# Altium schematic sheet Analog_Sensors_Sheet.SchDoc
size A2; SheetNumber: 3; SheetTotal: 4
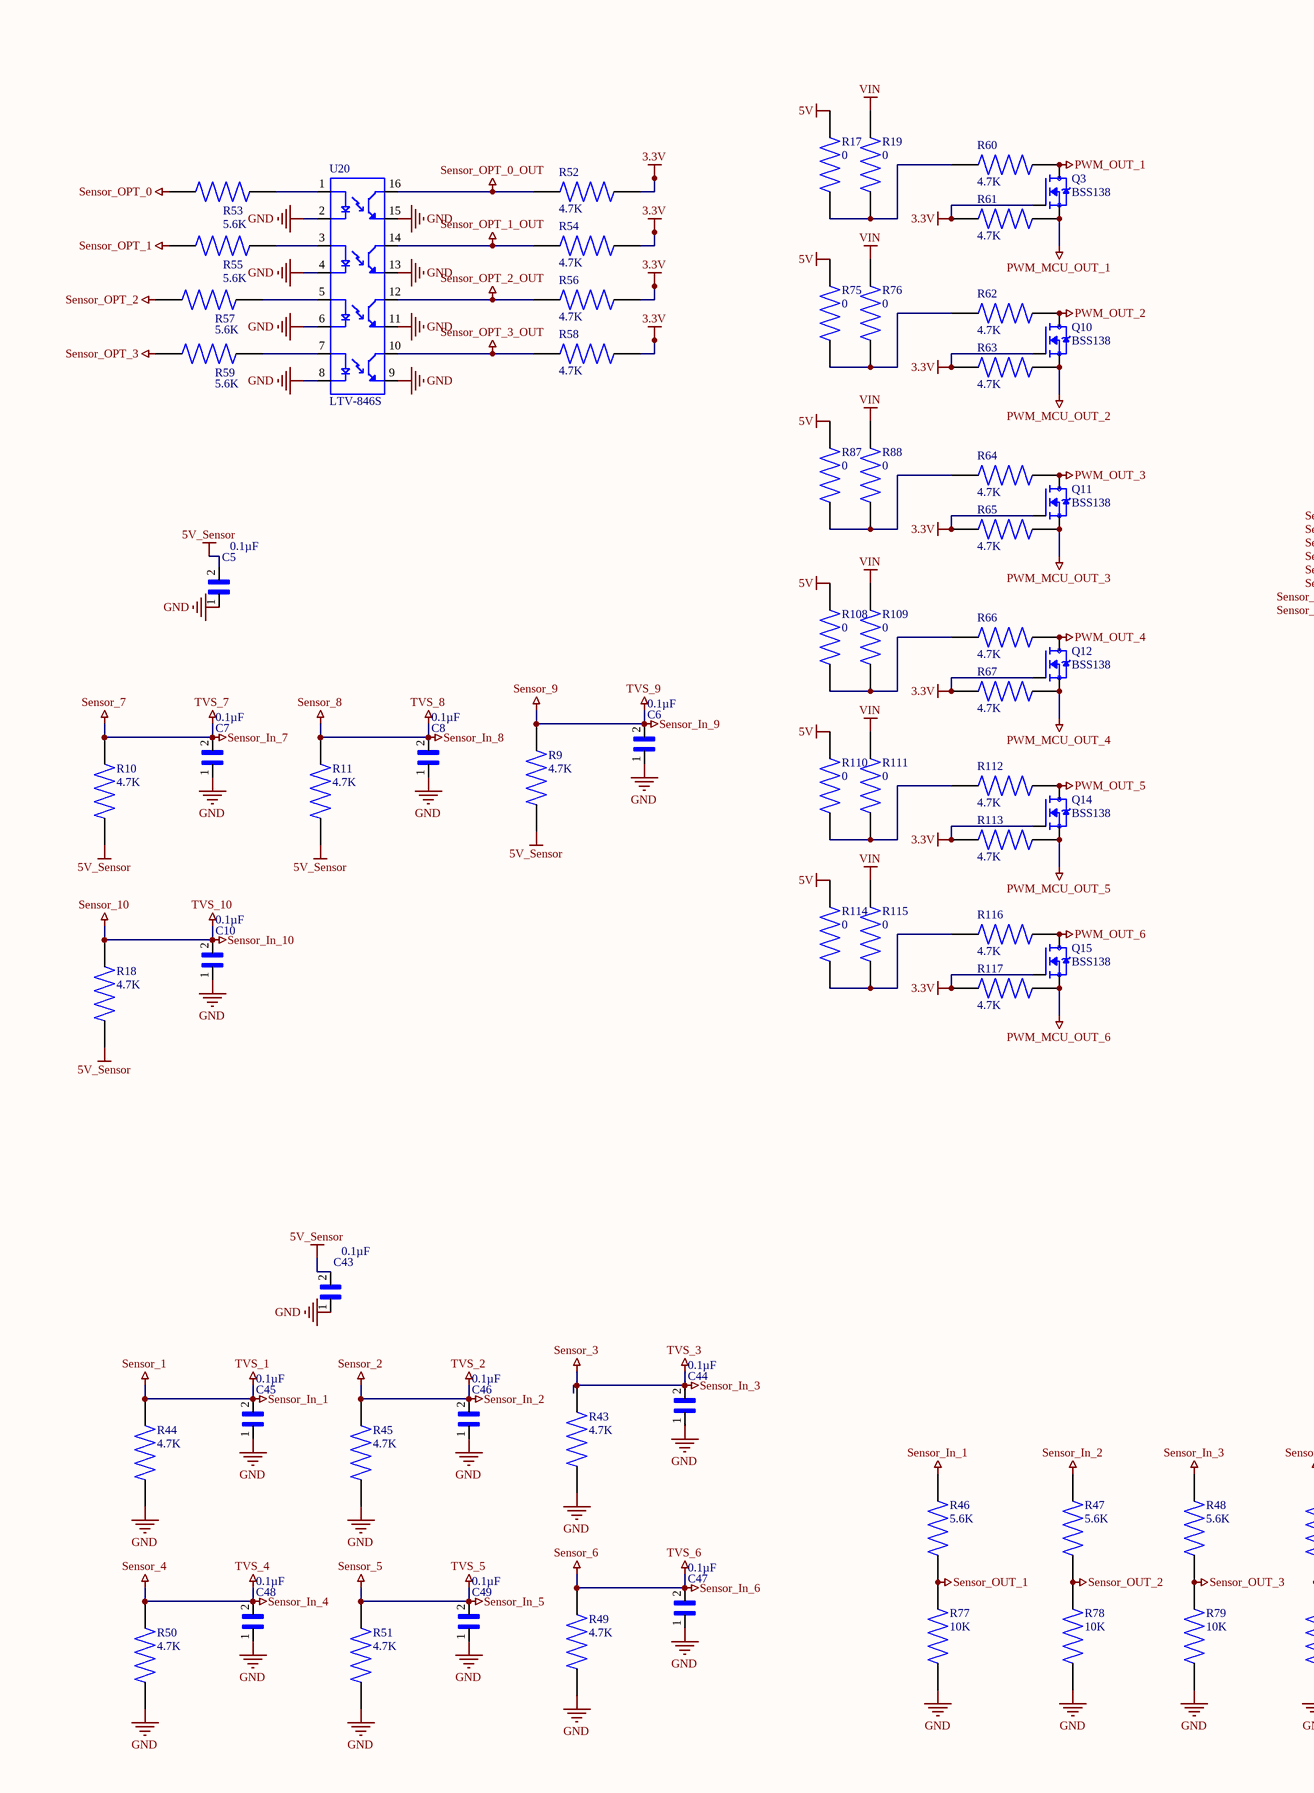
[diagram p0: Analog_Sensors_Sheet.SchDoc, left]
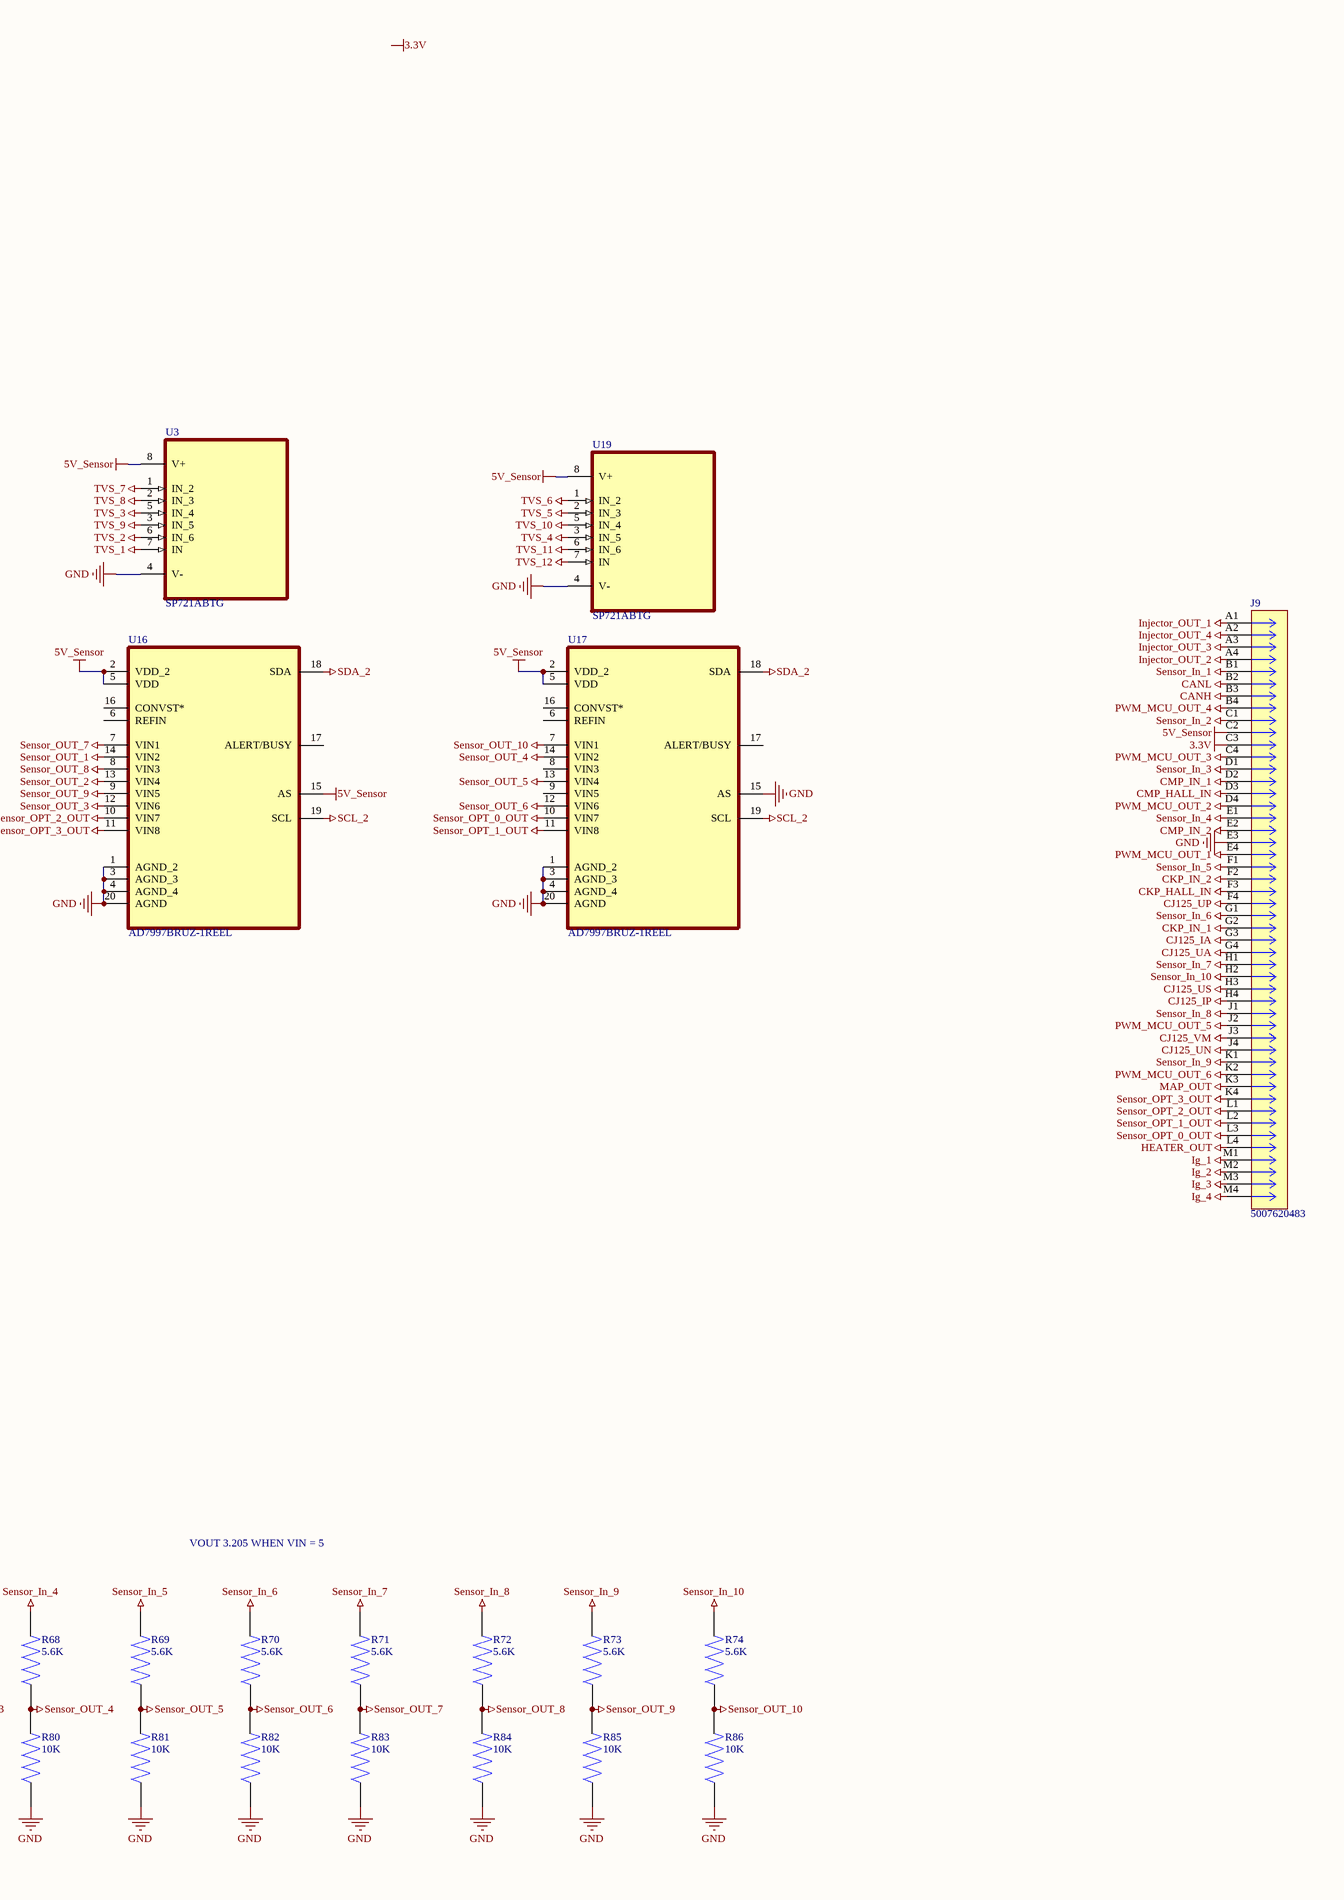
[diagram p1: Analog_Sensors_Sheet.SchDoc, right]

## Parts
C5  0.1µF  [CAPC1608X90N]
C6  0.1µF  [CAPC1608X90N]
C7  0.1µF  [CAPC1608X90N]
C8  0.1µF  [CAPC1608X90N]
C10  0.1µF  [CAPC1608X90N]
C43  0.1µF  [CAPC1608X90N]
C44  0.1µF  [CAPC1608X90N]
C45  0.1µF  [CAPC1608X90N]
C46  0.1µF  [CAPC1608X90N]
C47  0.1µF  [CAPC1608X90N]
C48  0.1µF  [CAPC1608X90N]
C49  0.1µF  [CAPC1608X90N]
J9  5007620483  [CONN_SD-500762-001_MOL]
Q3  BSS138  [SOT95P240X111-3N]
Q10  BSS138  [SOT95P240X111-3N]
Q11  BSS138  [SOT95P240X111-3N]
Q12  BSS138  [SOT95P240X111-3N]
Q14  BSS138  [SOT95P240X111-3N]
Q15  BSS138  [SOT95P240X111-3N]
R9  4.7K  [RESC3116X65N]
R10  4.7K  [RESC3116X65N]
R11  4.7K  [RESC3116X65N]
R17  0  [RESC3116X65N]
R18  4.7K  [RESC3116X65N]
R19  0  [RESC3116X65N]
R43  4.7K  [RESC3116X65N]
R44  4.7K  [RESC3116X65N]
R45  4.7K  [RESC3116X65N]
R46  5.6K  [RESC3116X65N]
R47  5.6K  [RESC3116X65N]
R48  5.6K  [RESC3116X65N]
R49  4.7K  [RESC3116X65N]
R50  4.7K  [RESC3116X65N]
R51  4.7K  [RESC3116X65N]
R52  4.7K  [RES_ERJS06J472V]
R53  5.6K  [RESC3216X70N]
R54  4.7K  [RES_ERJS06J472V]
R55  5.6K  [RESC3216X70N]
R56  4.7K  [RES_ERJS06J472V]
R57  5.6K  [RESC3216X70N]
R58  4.7K  [RES_ERJS06J472V]
R59  5.6K  [RESC3216X70N]
R60  4.7K  [RESC3116X65N]
R61  4.7K  [RESC3116X65N]
R62  4.7K  [RESC3116X65N]
R63  4.7K  [RESC3116X65N]
R64  4.7K  [RESC3116X65N]
R65  4.7K  [RESC3116X65N]
R66  4.7K  [RESC3116X65N]
R67  4.7K  [RESC3116X65N]
R68  5.6K  [RESC3116X65N]
R69  5.6K  [RESC3116X65N]
R70  5.6K  [RESC3116X65N]
R71  5.6K  [RESC3116X65N]
R72  5.6K  [RESC3116X65N]
R73  5.6K  [RESC3116X65N]
R74  5.6K  [RESC3116X65N]
R75  0  [RESC3116X65N]
R76  0  [RESC3116X65N]
R77  10K  [RESC3116X65N]
R78  10K  [RESC3116X65N]
R79  10K  [RESC3116X65N]
R80  10K  [RESC3116X65N]
R81  10K  [RESC3116X65N]
R82  10K  [RESC3116X65N]
R83  10K  [RESC3116X65N]
R84  10K  [RESC3116X65N]
R85  10K  [RESC3116X65N]
R86  10K  [RESC3116X65N]
R87  0  [RESC3116X65N]
R88  0  [RESC3116X65N]
R108  0  [RESC3116X65N]
R109  0  [RESC3116X65N]
R110  0  [RESC3116X65N]
R111  0  [RESC3116X65N]
R112  4.7K  [RESC3116X65N]
R113  4.7K  [RESC3116X65N]
R114  0  [RESC3116X65N]
R115  0  [RESC3116X65N]
R116  4.7K  [RESC3116X65N]
R117  4.7K  [RESC3116X65N]
U3  SP721ABTG  [SOIC127P600X175-8N]
U16  AD7997BRUZ-1REEL  [SOP65P640X120-20N]
U17  AD7997BRUZ-1REEL  [SOP65P640X120-20N]
U19  SP721ABTG  [SOIC127P600X175-8N]
U20  LTV-846S  [SOIC254P1016X460-16N]

## Nets
3.3V: J9.C3 Q3.1(G) Q10.1(G) Q11.1(G) Q12.1(G) Q14.1(G) Q15.1(G) R52.2 R54.2 R56.2 R58.2 R61.2 R63.2 R65.2 R67.2 R113.2 R117.2
5V: R17.2 R75.2 R87.2 R108.2 R110.2 R114.2
5V_Sensor: C5.2 C43.2 J9.C2 R9.1 R10.1 R11.1 R18.1 U3.8(V+) U16.2(VDD_2) U16.5(VDD) U16.15(AS) U17.2(VDD_2) U17.5(VDD) U19.8(V+)
CANH: J9.B3
CANL: J9.B2
CJ125_IA: J9.G3
CJ125_IP: J9.H4
CJ125_UA: J9.G4
CJ125_UN: J9.J4
CJ125_UP: J9.F4
CJ125_US: J9.H3
CJ125_VM: J9.J3
CKP_HALL_IN: J9.F3
CKP_IN_1: J9.G2
CKP_IN_2: J9.F2
CMP_HALL_IN: J9.D3
CMP_IN_1: J9.D2
CMP_IN_2: J9.E2
GND: C5.1 C6.1 C7.1 C8.1 C10.1 C43.1 C44.1 C45.1 C46.1 C47.1 C48.1 C49.1 J9.E3 R43.1 R44.1 R45.1 R49.1 R50.1 R51.1 R77.1 R78.1 R79.1 R80.1 R81.1 R82.1 R83.1 R84.1 R85.1 R86.1 U3.4(V-) U16.1(AGND_2) U16.3(AGND_3) U16.4(AGND_4) U16.20(AGND) U17.1(AGND_2) U17.3(AGND_3) U17.4(AGND_4) U17.15(AS) U17.20(AGND) U19.4(V-) U20.2(C1) U20.4(C2) U20.6(C3) U20.8(C4) U20.9(ET4) U20.11(ET3) U20.13(ET2) U20.15(ET1)
HEATER_OUT: J9.L4
Ig_1: J9.M1
Ig_2: J9.M2
Ig_3: J9.M3
Ig_4: J9.M4
Injector_OUT_1: J9.A1
Injector_OUT_2: J9.A4
Injector_OUT_3: J9.A3
Injector_OUT_4: J9.A2
MAP_OUT: J9.K3
PWM_MCU_OUT_1: J9.E4 Q3.2(S) R61.1
PWM_MCU_OUT_2: J9.D4 Q10.2(S) R63.1
PWM_MCU_OUT_3: J9.C4 Q11.2(S) R65.1
PWM_MCU_OUT_4: J9.B4 Q12.2(S) R67.1
PWM_MCU_OUT_5: J9.J2 Q14.2(S) R113.1
PWM_MCU_OUT_6: J9.K2 Q15.2(S) R117.1
PWM_OUT_1: Q3.3(D) R60.1
PWM_OUT_2: Q10.3(D) R62.1
PWM_OUT_3: Q11.3(D) R64.1
PWM_OUT_4: Q12.3(D) R66.1
PWM_OUT_5: Q14.3(D) R112.1
PWM_OUT_6: Q15.3(D) R116.1
SCL_2: U16.19(SCL) U17.19(SCL)
SDA_2: U16.18(SDA) U17.18(SDA)
Sensor_1: C45.2 J9.B1 R44.2 R46.2 U3.7(IN)  [also labelled Sensor_In_1, TVS_1]
Sensor_2: C46.2 J9.C1 R45.2 R47.2 U3.6(IN_6)  [also labelled Sensor_In_2, TVS_2]
Sensor_3: C44.2 J9.D1 R43.2 R48.2 U3.5(IN_4)  [also labelled Sensor_In_3, TVS_3]
Sensor_4: C48.2 J9.E1 R50.2 R68.2 U19.3(IN_5)  [also labelled Sensor_In_4, TVS_4]
Sensor_5: C49.2 J9.F1 R51.2 R69.2 U19.2(IN_3)  [also labelled Sensor_In_5, TVS_5]
Sensor_6: C47.2 J9.G1 R49.2 R70.2 U19.1(IN_2)  [also labelled Sensor_In_6, TVS_6]
Sensor_7: C7.2 J9.H1 R10.2 R71.2 U3.1(IN_2)  [also labelled Sensor_In_7, TVS_7]
Sensor_8: C8.2 J9.J1 R11.2 R72.2 U3.2(IN_3)  [also labelled Sensor_In_8, TVS_8]
Sensor_9: C6.2 J9.K1 R9.2 R73.2 U3.3(IN_5)  [also labelled Sensor_In_9, TVS_9]
Sensor_10: C10.2 J9.H2 R18.2 R74.2 U19.5(IN_4)  [also labelled Sensor_In_10, TVS_10]
Sensor_OPT_0: R53.1
Sensor_OPT_0_OUT: J9.L3 R52.1 U17.10(VIN7) U20.16(CT1)
Sensor_OPT_1: R55.1
Sensor_OPT_1_OUT: J9.L2 R54.1 U17.11(VIN8) U20.14(CT2)
Sensor_OPT_2: R57.1
Sensor_OPT_2_OUT: J9.L1 R56.1 U16.10(VIN7) U20.12(CT3)
Sensor_OPT_3: R59.1
Sensor_OPT_3_OUT: J9.K4 R58.1 U16.11(VIN8) U20.10(CT4)
Sensor_OUT_1: R46.1 R77.2 U16.14(VIN2)
Sensor_OUT_2: R47.1 R78.2 U16.13(VIN4)
Sensor_OUT_3: R48.1 R79.2 U16.12(VIN6)
Sensor_OUT_4: R68.1 R80.2 U17.14(VIN2)
Sensor_OUT_5: R69.1 R81.2 U17.13(VIN4)
Sensor_OUT_6: R70.1 R82.2 U17.12(VIN6)
Sensor_OUT_7: R71.1 R83.2 U16.7(VIN1)
Sensor_OUT_8: R72.1 R84.2 U16.8(VIN3)
Sensor_OUT_9: R73.1 R85.2 U16.9(VIN5)
Sensor_OUT_10: R74.1 R86.2 U17.7(VIN1)
TVS_11: U19.6(IN_6)
TVS_12: U19.7(IN)
VIN: R19.2 R76.2 R88.2 R109.2 R111.2 R115.2
NetR17_1: R17.1 R19.1 R60.2
NetR53_2: R53.2 U20.1(A1)
NetR55_2: R55.2 U20.3(A2)
NetR57_2: R57.2 U20.5(A3)
NetR59_2: R59.2 U20.7(A4)
NetR62_2: R62.2 R75.1 R76.1
NetR64_2: R64.2 R87.1 R88.1
NetR66_2: R66.2 R108.1 R109.1
NetR110_1: R110.1 R111.1 R112.2
NetR114_1: R114.1 R115.1 R116.2

Not connected (* = marked no-connect by the designer): U16 6(REFIN) 16(CONVST*) 17(ALERT/BUSY); U17 6(REFIN) 8(VIN3) 9(VIN5) 16(CONVST*) 17(ALERT/BUSY)

## Notes on the sheet
- VOUT 3.205 WHEN VIN = 5
- Labels drawn without touching a wire or pin: 3.3V

## Library data of the parts
C5-C8 C10 C43-C49 = 06035C104MAZ2A: Multilayer Ceramic Capacitors MLCC - SMD/SMT; Package: None; Price: None; Value: *; MP: 06035C104MAZ2A; Availability: Unavailable
Q3 Q10-Q12 Q14 Q15 = BSS138: N-Channel 50 V 220mA (Ta) 350mW (Ta) Surface Mount SOT-23-3; MF: onsemi; SnapEDA_Link: https://www.snapeda.com/parts/BSS138/Onsemi/view-part/?ref=snap; Package: SOT-23-3 ON Semiconductor; Value: *; MP: BSS138; Check_prices: https://www.snapeda.com/parts/BSS138/Onsemi/view-part/?ref=eda
R9-R11 R17-R19 R43-R45 R49-R51 R60-R67 R75 R76 R87 R88 R108-R117 = RC1206FR-074K7L: 4.7 kOhms Â±1% 0.25W, 1/4W Chip Resistor 1206 (3216 Metric) Moisture Resistant Thick Film; MF: Yageo; SnapEDA_Link: https://www.snapeda.com/parts/RC1206FR-074K7L/Yageo/view-part/?ref=snap; Package: 3116 Yageo; Value: *; MP: RC1206FR-074K7L; Check_prices: https://www.snapeda.com/parts/RC1206FR-074K7L/Yageo/view-part/?ref=eda
R46-R48 R68-R74 R77-R86 = AA1206JR-07470RL: Package: None; Price: None; Value: *; MP: AA1206JR-07470RL; Availability: Unavailable
R52 R54 R56 R58 = ERJS06J472V: Price: None; Availability: Unavailable; MP: ERJS06J472V; Package: None; Value: *
R53 R55 R57 R59 = RK73H2BTTD2200F: Res Thick Film 1206 220 Ohm 1% 0.25W(1/4W) ?100ppm/?C SMD Automotive T/R; Package: None; Price: None; Value: *; MP: RK73H2BTTD2200F; Availability: Unavailable
U3 U19 = SP721ABTG: TVS Diode Arrays; Package: None; Price: None; Value: *; MP: SP721ABTG; Availability: Unavailable
U16 U17 = AD7997BRUZ-1REEL: Adc, 10-Bit, 188Ksps, Tssop-20; Resolution (Bits):10Bit; Sampling Rate:188Ksps; Input Channel Type:Single Ended; Data Interface:2 Wire, I2C; Supply Voltage Type:Single; Supply Voltage Min:2.7V; Supply Voltage Max:5.5V Rohs Compliant: Yes |Analog Devices A; MP: AD7997BRUZ1; SnapEDA_Link: https://www.snapeda.com/parts/AD7997BRUZ1/Analog+Devices/view-part/?ref=snap; Package: None; Value: *; MF: Analog Devices; Check_prices: https://www.snapeda.com/parts/AD7997BRUZ1/Analog+Devices/view-part/?ref=eda
U20 = LTV-846S: Optoisolator Transistor Output 5000Vrms 4 Channel 16-SMD; MF: Lite-On Inc.; Digi-Key_Purchase_URL: https://www.digikey.com/product-detail/en/lite-on-inc/LTV-846S/160-1365-5-ND/385835?utm_source=snapeda&utm_medium=aggregator&utm_campaign=symbol; Digi-Key_Part_Number: 160-1365-5-ND; Value: *; MP: LTV-846S; Package: SMD-16 Lite-On; SnapEDA_Link: https://www.snapeda.com/parts/LTV-846S/Lite-On%20Inc./view-part/233858/?ref=snap
J9 = 5007620483: Package: None; Price: None; Value: *; MP: 5007620483; Availability: Unavailable